# EAGLE design sensor (EAGLE 9.6.2)
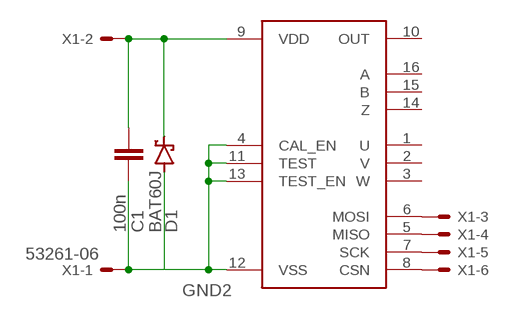
[diagram p0: schematic, sheet 1]

## Parts
C1  100n  C-EUC0603  [C0603]
D1  BAT60J  [SOD323_ST]
IC1  MT6835  [TSSOP-16]
X1  53261-06  [53261-06]

## Nets
GND2: C1.2 D1.A IC1.4(CAL_EN) IC1.11(TEST) IC1.12(VSS) IC1.13(TEST_EN) X1.1
N$21: IC1.5(MISO) X1.4
N$22: IC1.7(SCK) X1.5
N$23: IC1.8(CSN) X1.6
N$27: IC1.6(MOSI) X1.3
N$29: C1.1 D1.C IC1.9(VDD) X1.2
Unconnected: IC1.1(U) IC1.2(V) IC1.3(W) IC1.10(OUT) IC1.14(Z) IC1.15(B) IC1.16(A)

## Library data of the parts
C1 = resistor:C-EU: CAPACITOR, European symbol
D1 = diode:BAT60J: Schottky barrier diode Source: www.st.com, BAT60J.pdf
IC1 = mt6835:MT6835
X1 = con-molex:53?-06: CONNECTOR wire to board 1.25 mm (.049 inch) pitch header; MF: MOLEX; OC_FARNELL: 1125375; OC_NEWARK: unknown

## Board
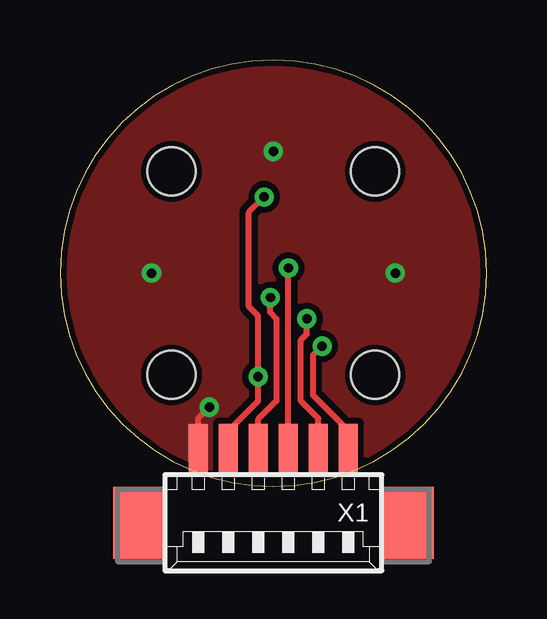
[diagram p1: board, top side]
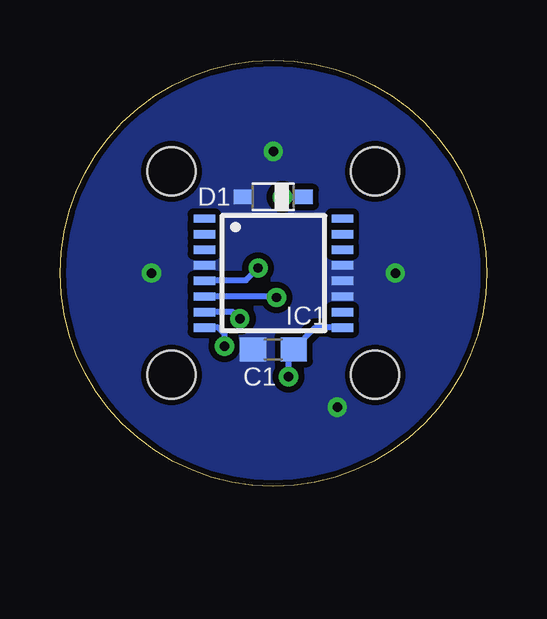
[diagram p2: board, bottom side, seen from below]

Size 17.78 x 17.78 mm. Coordinates in mm from the lower left corner, seen from the top.
Outline: 8.89,0 arc180 8.89,17.78 arc180 8.89,0
Copper layers (1*16): Top 0.035mm / dielectric 1.5mm / Bottom 0.035mm
Design rules "default *": minimum track width 6mil, minimum drill 0.35mm, track to track 6mil, track to pad 6mil, pad to pad 6mil, via to via 6mil, smd to smd 6mil, copper to edge 10mil, drill to drill 6mil, minimum pad ring 10mil, minimum via ring 8mil, stop-mask expansion 4mil, vias tented up to drill 0mil, thermal gap 10mil
Holes 2 mm at 13.13,13.13 4.65,13.13 4.65,4.65 13.13,4.65

### Footprints (pad centres in the part's own frame; a part is rotated, then mirrored left to right if it is on the bottom)
C0603 = smd 1.1 x 1: 1 -0.85,0; 2 0.85,0
SOD323_ST = smd 0.8 x 0.6: A 1.25,0; C -1.25,0
TSSOP-16 = smd 0.9 x 0.35: 1 -2.875,2.275; 2 -2.875,1.625; 3 -2.875,0.975; 4 -2.875,0.325; 5 -2.875,-0.325; 6 -2.875,-0.975; 7 -2.875,-1.625; 8 -2.875,-2.275; 9 2.875,-2.275; 10 2.875,-1.625; 11 2.875,-0.975; 12 2.875,-0.325; 13 2.875,0.325; 14 2.875,0.975; 15 2.875,1.625; 16 2.875,2.275
53261-06 = smd 0.8 x 2: 1 3.125,-2.5; 2 1.875,-2.5; 3 0.625,-2.5; 4 -0.625,-2.5; 5 -1.875,-2.5; 6 -3.125,-2.5 | smd 2.1 x 3: S1 5.625,0.625; S2 -5.625,0.625

### Placement (x,y rotation side)
C1  8.89,5.71 180 bottom
D1  8.89,12.06 180 bottom
IC1  8.89,8.89 0 bottom
X1  8.89,-0.89 180 top

### Tracks (layer width: path | path; a pad name or v marks a point on that pad's centre or on a via)
GND2  (via drill 0.39)
  Top 0.254: X1.1 5.77,2.84 v6.22,3.3
  other vias: 8.89,13.97 3.81,8.89 13.97,8.89
  pour Bottom (isolate 0.254, no thermals): -1.27,19.05 19.05,19.05 19.05,-3.81 -1.27,-3.81
  pour Top (isolate 0.254, no thermals): -3.81,19.05 21.59,19.05 21.59,-3.81 -3.81,-3.81
N$21  (via drill 0.39)
  Top 0.254: v9.53,9.1 9.52,9.09 X1.4
  Bottom 0.254: v9.53,9.1 10.03,8.59 11.74,8.59 IC1.5
N$22  (via drill 0.39)
  Top 0.254: X1.5 10.77,2.82 10.03,3.56 10.03,6.1 10.29,6.35 v10.29,6.98
  Bottom 0.254: v10.29,6.98 10.57,7.26 IC1.7
N$23  (via drill 0.39)
  Top 0.254: X1.6 12.02,2.34 10.54,3.81 10.54,5.46 v10.92,5.84
  Bottom 0.254: v10.92,5.84 10.92,6.35 11.19,6.61 IC1.8
N$27  (via drill 0.39)
  Top 0.254: X1.3 8.27,2.8 9.02,3.56 9.02,6.98 8.76,7.24 v8.76,7.87
  Bottom 0.254: v8.76,7.87 8.8,7.91 IC1.6
N$29  (via drill 0.39)
  Top 0.254: X1.2 7.02,2.32 8.26,3.56 v8.26,4.57 8.26,7.11 7.87,7.49 7.87,11.43 v8.51,12.06
  Bottom 0.254: 8,5.76 C1.1 | IC1.9 7.14,6.61 C1.1 | v8.26,4.57 8.26,5.5 C1.1 | v8.51,12.06 D1.C